# Altium project computer.PrjPcb
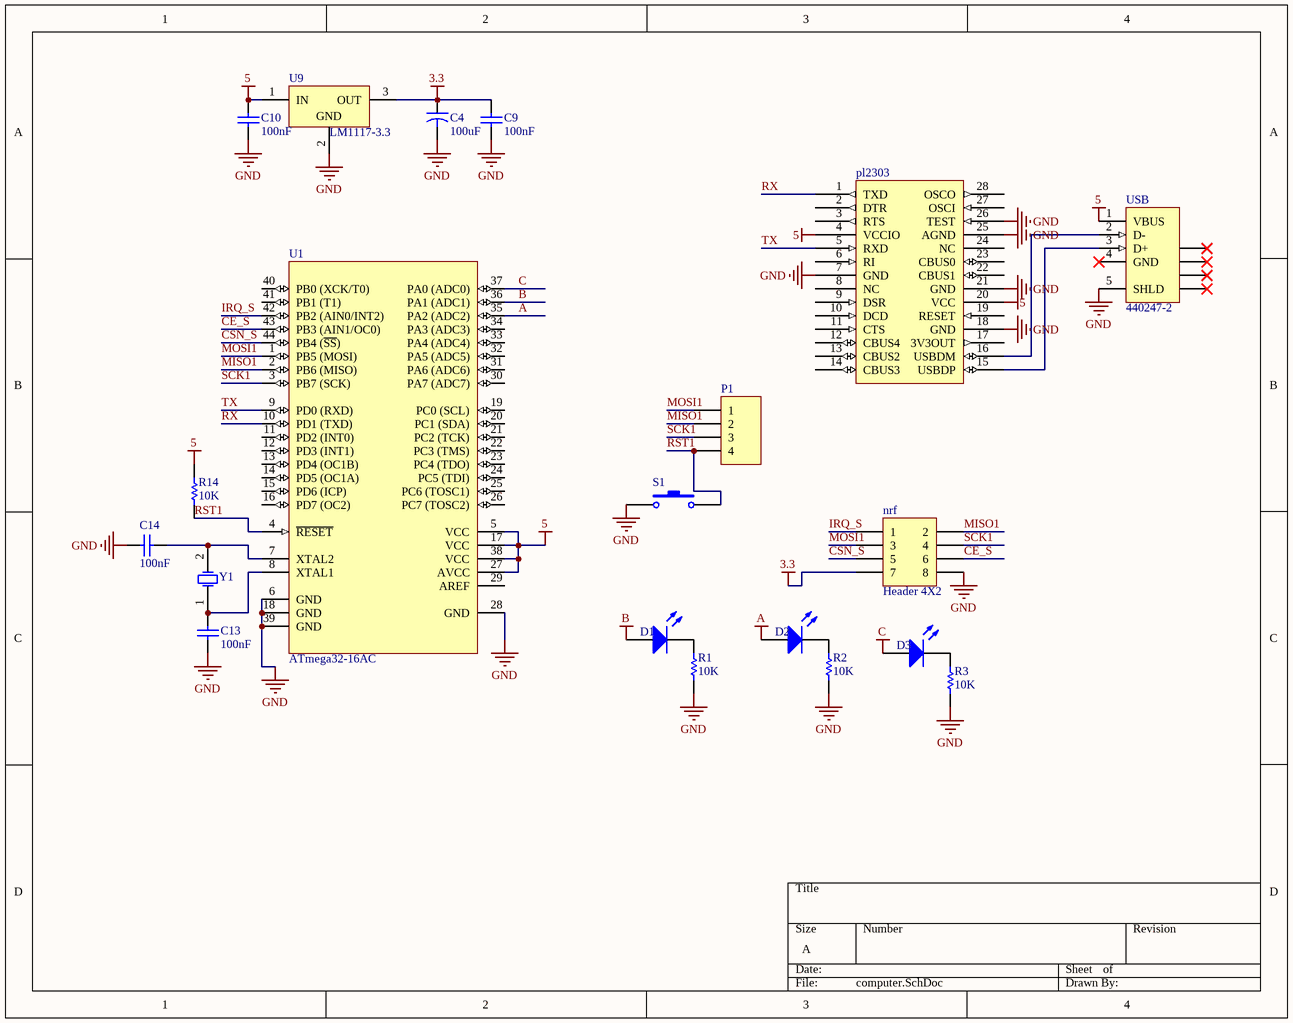
[diagram p0: computer.SchDoc]
1 sheet, 20 parts. Net scope: global (net labels, ports and power ports of the same name join across sheets).
Board file: computer.PcbDoc

## Sheet computer.SchDoc
size A

### Parts
C4  value 100uF  [cap]  (hidden comment: Cap2)
C9  value 100nF  [H1X02F]  (hidden comment: Cap)
C10  value 100nF  [H1X02F]  (hidden comment: Cap)
C13  value 100nF  [H1X02F]  (hidden comment: Cap)
C14  value 100nF  [H1X02F]  (hidden comment: Cap)
D1  LED0  [LED3MM]  (value not drawn)
D2  LED0  [LED3MM]  (value not drawn)
D3  LED0  [LED3MM]  (value not drawn)
nrf  Header 4X2  [HDR2X4]
P1  Header 4  [H1X04F]  (value not drawn)
pl2303  pl2303  [SSOP28]  (value not drawn)
R1  value 10K  [smd[1206]]  (hidden comment: Res1)
R2  value 10K  [smd[1206]]  (hidden comment: Res1)
R3  value 10K  [smd[1206]]  (hidden comment: Res1)
R14  value 10K  [AXIAL-0.3]  (hidden comment: Res1)
S1  SW-PB  [PB4]  (value not drawn)
U1  ATmega32-16AC  [TQFP44]
U9  LM1117-3.3  [SOT223]
USB  440247-2  [MiniUSB-B]
Y1  XTAL  [CRYSTALL]  (value not drawn)

### Nets
3.3: C4.1 C9.1 nrf.7 U9.3(OUT)
5: C10.1 pl2303.4(VCCIO) pl2303.20(VCC) R14.1 U1.5(VCC) U1.17(VCC) U1.27(AVCC) U1.38(VCC) U9.1(IN) USB.1(VBUS)
A: D2.1(A) U1.35(PA2_(ADC2))
B: D1.1(A) U1.36(PA1_(ADC1))
C: D3.1(A) U1.37(PA0_(ADC0))
GND: C4.2 C9.2 C10.2 C13.2 C14.1 nrf.8 pl2303.7(GND) pl2303.18(GND) pl2303.21(GND) pl2303.25(AGND) pl2303.26(TEST) R1.1 R2.1 R3.1 S1.1 U1.6(GND) U1.18(GND) U1.28(GND) U1.39(GND) U9.2(GND) USB.5(SHLD)
CE_S: nrf.6 U1.43(PB3_(AIN1/OC0))
CSN_S: nrf.5 U1.44(PB4_(~{SS}))
IRQ_S: nrf.1 U1.42(PB2_(AIN0/INT2))
MISO1: nrf.2 P1.2 U1.2(PB6_(MISO))
MOSI1: nrf.3 P1.1 U1.1(PB5_(MOSI))
RST1: P1.4 R14.2 S1.2 U1.4(~{RESET})
RX: pl2303.1(TXD) U1.10(PD1_(TXD))
SCK1: nrf.4 P1.3 U1.3(PB7_(SCK))
TX: pl2303.5(RXD) U1.9(PD0_(RXD))
NetC13_1: C13.1 U1.8(XTAL1) Y1.1(OSC1)
NetC14_2: C14.2 U1.7(XTAL2) Y1.2(OSC2)
NetD1_2: D1.2(K) R1.2
NetD2_2: D2.2(K) R2.2
NetD3_2: D3.2(K) R3.2
Netpl2303_15: pl2303.15(USBDP) USB.3(D+)
Netpl2303_16: pl2303.16(USBDM) USB.2(D-)

Not connected (* = marked no-connect by the designer): pl2303 2(DTR) 3(RTS) 6(RI) 8(NC) 9(DSR) 10(DCD) 11(CTS) 12(CBUS4) 13(CBUS2) 14(CBUS3) 17(3V3OUT) 19(RESET) 22(CBUS1) 23(CBUS0) 24(NC) 27(OSCI) 28(OSCO); U1 11(PD2_(INT0)) 12(PD3_(INT1)) 13(PD4_(OC1B)) 14(PD5_(OC1A)) 15(PD6_(ICP)) 16(PD7_(OC2)) 19(PC0_(SCL)) 20(PC1_(SDA)) 21(PC2_(TCK)) 22(PC3_(TMS)) 23(PC4_(TDO)) 24(PC5_(TDI)) 25(PC6_(TOSC1)) 26(PC7_(TOSC2)) 29(AREF) 30(PA7_(ADC7)) 31(PA6_(ADC6)) 32(PA5_(ADC5)) 33(PA4_(ADC4)) 34(PA3_(ADC3)) 40(PB0_(XCK/T0)) 41(PB1_(T1)); USB 4(GND)* 6(SHLD)* 7(SHLD)* 8(SHLD)* 9(SHLD)*

### Library data of the parts
C4 = Cap2: Capacitor; Published: 23-Sep-2002; PackageReference: CAPR5-4X5; Publisher: Altium Limited
C9 C10 C13 C14 = Cap: Capacitor; Published: 8-Jun-2000; LatestRevisionDate: 17-Jul-2002; LatestRevisionNote: Re-released for DXP Platform.; PackageReference: RAD-0.3; Publisher: Altium Limited
D1-D3 = LED0: Typical INFRARED GaAs LED; Published: 8-Jun-2000; LatestRevisionDate: 08-Jul-2005; LatestRevisionNote: Mech Layer 1 removed.; PackageReference: LED-0; Publisher: Altium Limited
nrf = Header 4X2: Header, 4-Pin, Dual row; LatestRevisionDate: 17-Jul-2002; LatestRevisionNote: Re-released for DXP Platform.; Publisher: Altium Limited
P1 = Header 4: Header, 4-Pin; LatestRevisionDate: 17-Jul-2002; LatestRevisionNote: Re-released for DXP Platform.; Publisher: Altium Limited
pl2303 = ft232rl: ft232rl USB <> UART
R1-R3 R14 = Res1: Resistor; Published: 8-Jun-2000; LatestRevisionDate: 17-Jul-2002; LatestRevisionNote: Re-released for DXP Platform.; PackageReference: AXIAL-0.3; Publisher: Altium Limited
S1 = SW-PB: Switch; Published: 24-Mar-1999; LatestRevisionDate: 17-Jul-2002; LatestRevisionNote: Re-released for DXP Platform.; PackageReference: SPST-2; Publisher: Altium Limited
U1 = ATmega32-16AC: 8-Bit AVR Microcontroller with 32K Bytes of In-System Programmable Flash Memory; Published: 17-Sep-2003; LatestRevisionDate: 13-Apr-2006; LatestRevisionNote: IPC-7351 Footprint Added.; DatasheetVersion: 2503C-AVR-10/02; PackageVersion: rev.B, Oct-2001; PackageReference: 44A; Publisher: Altium Limited; PackageDescription: 44-Pin Thin Quad Flat Pack 0.8 mm Pitch; ComponentLink1Description: Manufacturer Link; ComponentLink1URL: http://www.atmel.com; ComponentLink2Description: Datasheet; ComponentLink2URL: http://www.atmel.com/dyn/resources/prod_documents/doc2503.pdf
U9 = LF33ABV: 500mA, Very Low Drop (0.45V) Voltage Regulator; pin to pad: 1>3 2>1 3>2; Published: 24-Aug-2001; LatestRevisionDate: 06-Jun-2005; LatestRevisionNote: PCB Pin sequence re-ordered.; DatasheetVersion: Feb-2004; PackageVersion: Jul-2004; PackageReference: TO-220A; Publisher: Altium Limited; PackageDescription: TO, Thru-Hole, Vertical, Heatsink Mounted; 3 In-Line Leads; Pitch 2.54 mm; ComponentLink1Description: Manufacturer Link; ComponentLink1URL: http://www.st.com/; ComponentLink2Description: Datasheet; ComponentLink2URL: http://www.st.com/stonline/books/pdf/docs/2574.pdf
USB = 440247-2: USB 2.0, Right Angle, SMT, B Type, Receptacle, 5 Position, Black; Note: Directive 2000/53/EC (ELV) Compliant; ContactMaterial: Copper Alloy; ContactPlating: Gold (30); PCB_Layout: Complies with manufacturer's recommendation.; DrillSize: Corresponds to nominal value.; PanelGround: Without; Published: 15-Jul-2004; DatasheetDocument: 27-Jun-2003; PackageDocument: 27-Jun-2003; PackageReference: 440247; Publisher: Altium Limited; HousingMaterial: Thermoplastic; ComponentLink1Description: Manufacturer Link; ComponentLink1URL: http://www.tycoelectronics.com/; ComponentLink2Description: Packaging Specification; ComponentLink2URL: http://ecommas.tycoelectronics.com/commerce/DocumentDelivery/DDEController?Action=showdoc&DocId=Customer+Drawing%7F440247%7FD%7Fpdf%7FEnglish%7FC_440247_D.pdf
Y1 = XTAL: Crystal Oscillator; Published: 8-Jun-2000; LatestRevisionDate: 17-Jul-2002; LatestRevisionNote: Re-released for DXP Platform.; PackageReference: R38; Publisher: Altium Limited